# EAGLE design elevator-motherboard-revA (EAGLE 9.4.0)
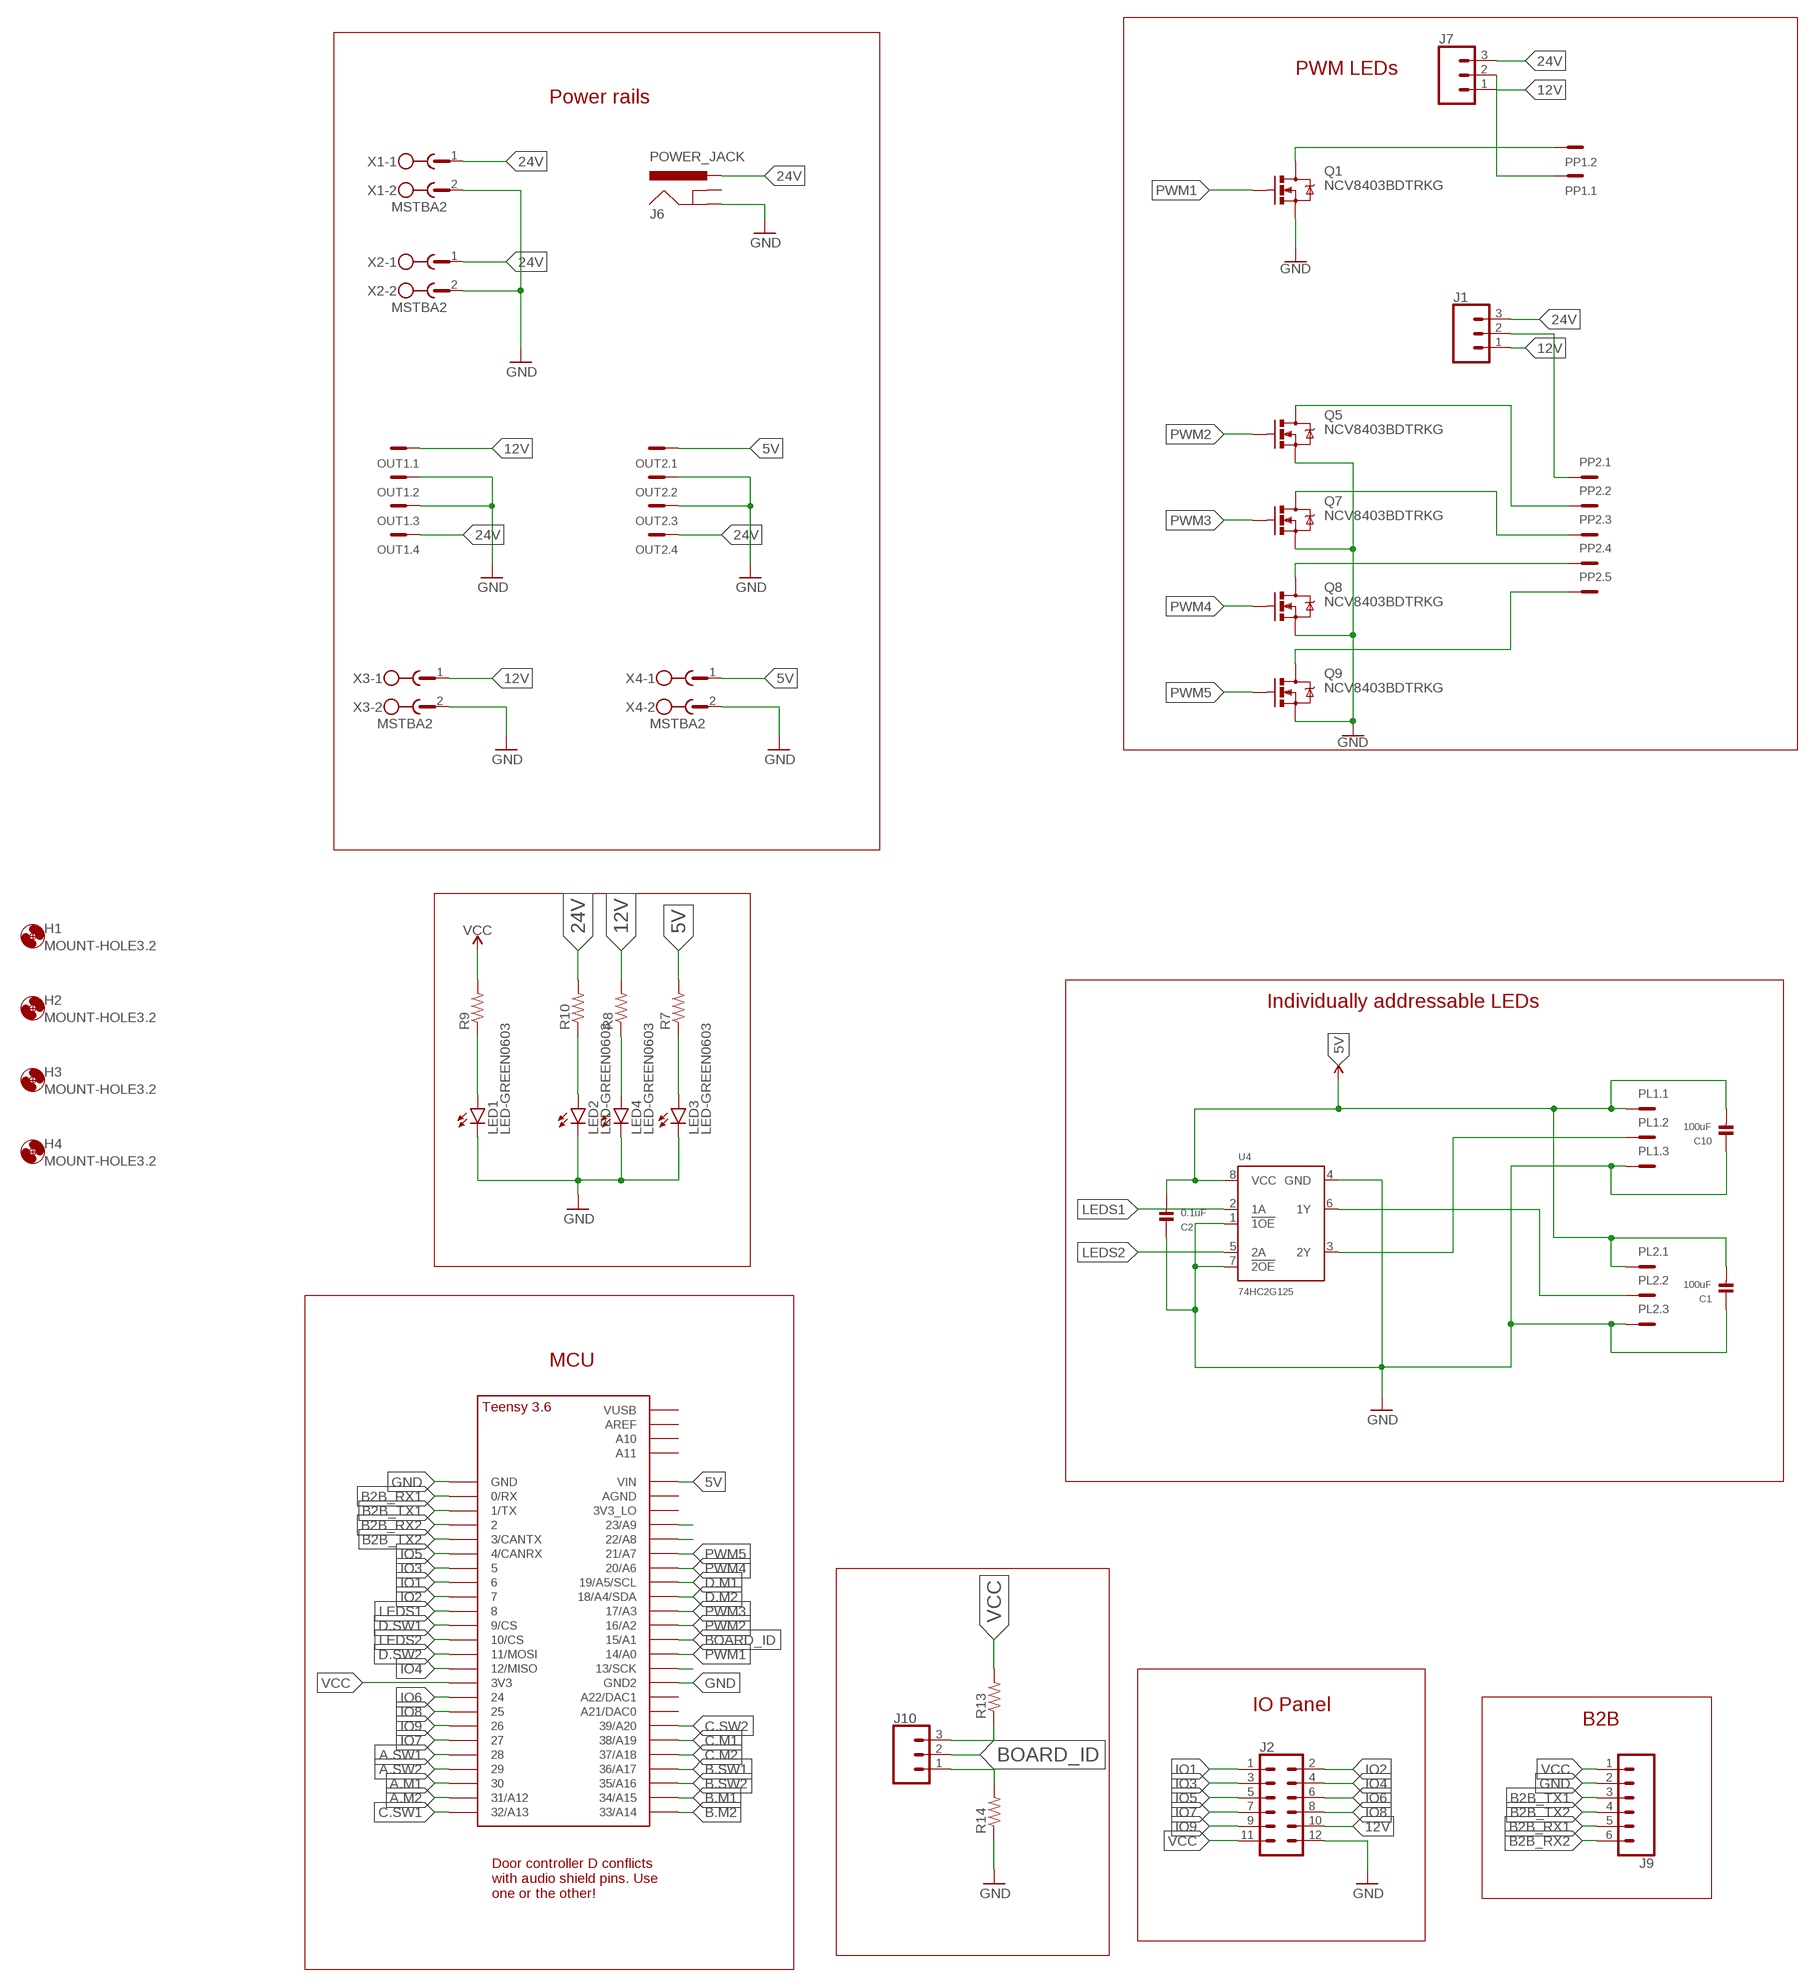
[diagram p0: schematic, sheet 1, part 1 of 2]
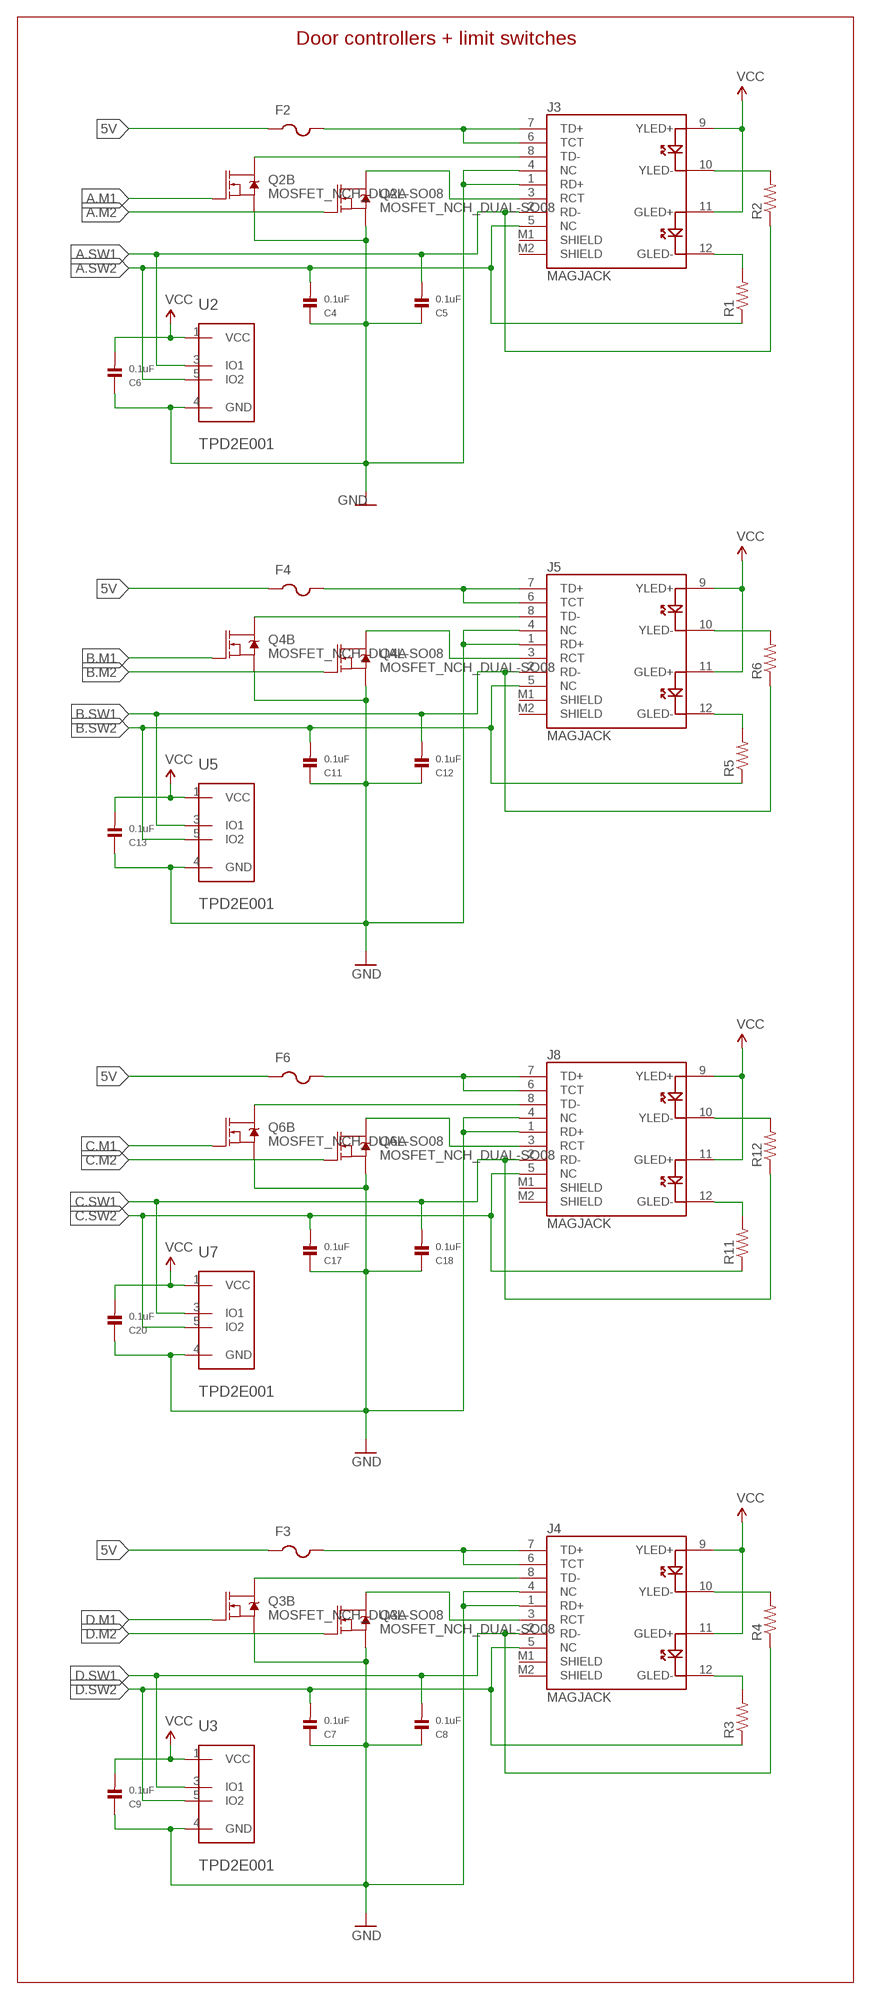
[diagram p1: schematic, sheet 1, part 2 of 2]

## Parts
C1  100uF  CAP_CERAMIC1206  [1206]
C2  0.1uF  CAP_CERAMIC0603  [0603]
C4  0.1uF  CAP_CERAMIC0603  [0603]
C5  0.1uF  CAP_CERAMIC0603  [0603]
C6  0.1uF  CAP_CERAMIC0603  [0603]
C7  0.1uF  CAP_CERAMIC0603  [0603]
C8  0.1uF  CAP_CERAMIC0603  [0603]
C9  0.1uF  CAP_CERAMIC0603  [0603]
C10  100uF  CAP_CERAMIC1206  [1206]
C11  0.1uF  CAP_CERAMIC0603  [0603]
C12  0.1uF  CAP_CERAMIC0603  [0603]
C13  0.1uF  CAP_CERAMIC0603  [0603]
C17  0.1uF  CAP_CERAMIC0603  [0603]
C18  0.1uF  CAP_CERAMIC0603  [0603]
C20  0.1uF  CAP_CERAMIC0603  [0603]
F2  PTCFUSE-1206  [R1206]
F3  PTCFUSE-1206  [R1206]
F4  PTCFUSE-1206  [R1206]
F6  PTCFUSE-1206  [R1206]
H1  MOUNT-HOLE3.2  [3,2]
H2  MOUNT-HOLE3.2  [3,2]
H3  MOUNT-HOLE3.2  [3,2]
H4  MOUNT-HOLE3.2  [3,2]
J1  CONN_03  [1X03]
J2  CONN_06X22X6SHR  [2X6-SHROUDED]
J3  MAGJACK  [MAGJACK]
J4  MAGJACK  [MAGJACK]
J5  MAGJACK  [MAGJACK]
J6  POWER_JACK  [POWER_JACK_PTH]
J7  CONN_03  [1X03]
J8  MAGJACK  [MAGJACK]
J9  CONN_06NO_SILK_FEMALE_PTH  [1X06_NO_SILK]
J10  CONN_03  [1X03]
LED1  LED-GREEN0603  [0603-GREEN]
LED2  LED-GREEN0603  [0603-GREEN]
LED3  LED-GREEN0603  [0603-GREEN]
LED4  LED-GREEN0603  [0603-GREEN]
OUT1  MC4  [MC4]
OUT2  MC4  [MC4]
PL1  MC3  [MC3]
PL2  MC3  [MC3]
PP1  MC2  [MC2]
PP2  MC5  [MC5]
Q1  NCV8403BDTRKG  MOSFET-NCHANNELFDD8780  [DPAK]
Q2  MOSFET_NCH_DUAL-SO08  [SO08]
Q3  MOSFET_NCH_DUAL-SO08  [SO08]
Q4  MOSFET_NCH_DUAL-SO08  [SO08]
Q5  NCV8403BDTRKG  MOSFET-NCHANNELFDD8780  [DPAK]
Q6  MOSFET_NCH_DUAL-SO08  [SO08]
Q7  NCV8403BDTRKG  MOSFET-NCHANNELFDD8780  [DPAK]
Q8  NCV8403BDTRKG  MOSFET-NCHANNELFDD8780  [DPAK]
Q9  NCV8403BDTRKG  MOSFET-NCHANNELFDD8780  [DPAK]
R1  R-US_R0603  [R0603]
R2  R-US_R0603  [R0603]
R3  R-US_R0603  [R0603]
R4  R-US_R0603  [R0603]
R5  R-US_R0603  [R0603]
R6  R-US_R0603  [R0603]
R7  R-US_R0603  [R0603]
R8  R-US_R0603  [R0603]
R9  R-US_R0603  [R0603]
R10  R-US_R0603  [R0603]
R11  R-US_R0603  [R0603]
R12  R-US_R0603  [R0603]
R13  R-US_R0603  [R0603]
R14  R-US_R0603  [R0603]
U2  TPD2E001  [SOT23-5L]
U3  TPD2E001  [SOT23-5L]
U4  74HC2G125  [TSSOP8]
U5  TPD2E001  [SOT23-5L]
U7  TPD2E001  [SOT23-5L]
U$1  TEENSY_3.5/3.6_BASIC  [TEENSY_3.5/3.6_BASIC]
X1  MSTBA2  [MSTBA2]
X2  MSTBA2  [MSTBA2]
X3  MSTBA2  [MSTBA2]
X4  MSTBA2  [MSTBA2]

## Nets
5V: C1.2 C2.2 C10.2 F2.1 F3.1 F4.1 F6.1 OUT2.1 PL1.1 PL2.1 R7.2 U4.8(VCC) U$1.VIN X4.1 ; supply symbol labelled 12V
12V: J1.1 J2.10 J7.1 OUT1.1 R8.2 X3.1
24V: J1.3 J6.PWR J7.3 OUT1.4 OUT2.4 R10.2 X1.1 X2.1
A.M1: Q2.4(B:G) U$1.30
A.M2: Q2.2(A:G) U$1.31/A12
A.SW1: C5.2 J3.2(RD-) R2.1 U2.3(IO1) U$1.28
A.SW2: C4.2 J3.5(NC) R1.1 U2.5(IO2) U$1.29
B2B_RX1: J9.5 U$1.0/RX
B2B_RX2: J9.6 U$1.2
B2B_TX1: J9.3 U$1.1/TX
B2B_TX2: J9.4 U$1.3/CANTX
B.M1: Q4.4(B:G) U$1.34/A15
B.M2: Q4.2(A:G) U$1.33/A14
B.SW1: C12.2 J5.2(RD-) R6.1 U5.3(IO1) U$1.36/A17
B.SW2: C11.2 J5.5(NC) R5.1 U5.5(IO2) U$1.35/A16
BOARD_ID: J10.2 U$1.15/A1
C.M1: Q6.4(B:G) U$1.38/A19
C.M2: Q6.2(A:G) U$1.37/A18
C.SW1: C18.2 J8.2(RD-) R12.1 U7.3(IO1) U$1.32/A13
C.SW2: C17.2 J8.5(NC) R11.1 U7.5(IO2) U$1.39/A20
D.M1: Q3.4(B:G) U$1.19/A5/SCL
D.M2: Q3.2(A:G) U$1.18/A4/SDA
D.SW1: C8.2 J4.2(RD-) R4.1 U3.3(IO1) U$1.9/CS
D.SW2: C7.2 J4.5(NC) R3.1 U3.5(IO2) U$1.11/MOSI
GND: C1.1 C2.1 C4.1 C5.1 C6.1 C7.1 C8.1 C9.1 C10.1 C11.1 C12.1 C13.1 C17.1 C18.1 C20.1 J2.12 J3.1(RD+) J3.4(NC) J4.1(RD+) J4.4(NC) J5.1(RD+) J5.4(NC) J6.GND J8.1(RD+) J8.4(NC) J9.2 LED1.C LED2.C LED3.C LED4.C OUT1.2 OUT1.3 OUT2.2 OUT2.3 PL1.3 PL2.3 Q1.3(S) Q2.1(A:S) Q2.3(B:S) Q3.1(A:S) Q3.3(B:S) Q4.1(A:S) Q4.3(B:S) Q5.3(S) Q6.1(A:S) Q6.3(B:S) Q7.3(S) Q8.3(S) Q9.3(S) R14.1 U2.4(GND) U3.4(GND) U4.1(!1OE) U4.4(GND) U4.7(!2OE) U5.4(GND) U7.4(GND) U$1.GND U$1.GND2 X1.2 X2.2 X3.2 X4.2
IO1: J2.1 U$1.6
IO2: J2.2 U$1.7
IO3: J2.3 U$1.5
IO4: J2.4 U$1.12/MISO
IO5: J2.5 U$1.4/CANRX
IO6: J2.6 U$1.24
IO7: J2.7 U$1.27
IO8: J2.8 U$1.25
IO9: J2.9 U$1.26
LEDS1: U4.2(1A) U$1.8
LEDS2: U4.5(2A) U$1.10/CS
N$1: F2.2 J3.6(TCT) J3.7(TD+)
N$2: J3.8(TD-) Q2.5(B:D) Q2.6(B:D)
N$3: J3.3(RCT) Q2.7(A:D) Q2.8(A:D)
N$4: PP1.2 Q1.4(D)
N$5: PL2.2 U4.6(1Y)
N$6: PL1.2 U4.3(2Y)
N$7: J3.10(YLED-) R2.2
N$8: J3.12(GLED-) R1.2
N$9: F3.2 J4.6(TCT) J4.7(TD+)
N$10: J4.8(TD-) Q3.5(B:D) Q3.6(B:D)
N$11: J4.3(RCT) Q3.7(A:D) Q3.8(A:D)
N$12: J4.10(YLED-) R4.2
N$13: PP2.2 Q5.4(D)
N$14: PP2.3 Q7.4(D)
N$15: PP2.4 Q8.4(D)
N$16: PP2.5 Q9.4(D)
N$17: J4.12(GLED-) R3.2
N$18: F4.2 J5.6(TCT) J5.7(TD+)
N$19: J5.8(TD-) Q4.5(B:D) Q4.6(B:D)
N$20: J5.3(RCT) Q4.7(A:D) Q4.8(A:D)
N$21: J5.10(YLED-) R6.2
N$22: J5.12(GLED-) R5.2
N$23: LED1.A R9.1
N$24: LED2.A R10.1
N$25: LED3.A R7.1
N$26: LED4.A R8.1
N$27: J10.3 R13.1
N$28: F6.2 J8.6(TCT) J8.7(TD+)
N$29: J8.8(TD-) Q6.5(B:D) Q6.6(B:D)
N$30: J8.3(RCT) Q6.7(A:D) Q6.8(A:D)
N$31: J8.10(YLED-) R12.2
N$32: J8.12(GLED-) R11.2
N$33: J10.1 R14.2
N$34: J7.2 PP1.1
N$35: J1.2 PP2.1
N$50: U$1.23/A9
N$51: U$1.22/A8
N$60: U$1.13/SCK
PWM1: Q1.1(G) U$1.14/A0
PWM2: Q5.1(G) U$1.16/A2
PWM3: Q7.1(G) U$1.17/A3
PWM4: Q8.1(G) U$1.20/A6
PWM5: Q9.1(G) U$1.21/A7
VCC: C6.2 C9.2 C13.2 C20.2 J2.11 J3.9(YLED+) J3.11(GLED+) J4.9(YLED+) J4.11(GLED+) J5.9(YLED+) J5.11(GLED+) J8.9(YLED+) J8.11(GLED+) J9.1 R9.2 R13.2 U2.1(VCC) U3.1(VCC) U5.1(VCC) U7.1(VCC) U$1.3V3
Unconnected: J3.M1(SHIELD) J3.M2(SHIELD) J4.M1(SHIELD) J4.M2(SHIELD) J5.M1(SHIELD) J5.M2(SHIELD) J6.GNDBREAK J8.M1(SHIELD) J8.M2(SHIELD) U$1.3V3_LO U$1.21/DAC0(A21/DAC0) U$1.A10 U$1.A11 U$1.A22/DAC1 U$1.AGND U$1.AREF U$1.VUSB

## Notes on the sheet
- Door controllers + limit switches
- PWM LEDs
- Power rails
- Individually addressable LEDs
- MCU
- IO Panel
- B2B
- Door controller D conflicts
  with audio shield pins. Use
  one or the other!

## Library data of the parts
C1 C2 C4-C13 C17 C18 C20 = microbuilder:CAP_CERAMIC: Ceramic Capacitors 0402 - 0402 Surface Mount Capacitors 16pF 50V 5% [Digikey: 445-4899-2-ND] 18pF 50V 5% [Digikey: 490-1281-2-ND] 22pF 50V 5% [Digikey: 490-1283-2-ND] 68pF 50V 5% [Digikey: 490-1289-2-ND] 0.1uF 10V 10% [Digikey: 490-1318-2-ND] 1.0uF 6.3V 10% [Digikey: 490-1320-2-ND] 0603 - 0603 Surface Mount Capacitors 16 pF 50V 5% [Digikey: 445-5051-2-ND] 22 pF 50V [Digikey: PCC220ACVTR-ND] 33 pF 50V 5% [Digikey: 490-1415-1-ND] 56pF 50V 5% [Digikey: 490-1421-1-ND] 220pF 50V 5% [Digikey: 445-1285-1-ND] 680 pF 50V 2200 pF 50V 5% C0G [Digikey: 445-1297-1-ND] 5600 pF 100V 5% X7R [Digikey: 478-3711-1-ND] 0.1 µF 25V 10% [Digikey: PCC2277TR-ND] 0.22 µF 16V 10% X7R [Digikey: 445-1318-1-ND] 1.0 µF 25V 10% [Digikey: 445-5146-2-ND] 0603 - RF Specific 3pF 250V +/-0.1pF RF [Digikey: 712-1347-1-ND] 18 pF 250V 5% [Digikey: 478-3505-1-ND or 712-1322-1-ND] 56 pF 250V 5% C0G RF [Digikey: 490-4867-1-ND] 68 pF 250V RF [Digikey: 490-4868-1-ND] 0805 - 0805 Surface Mount Capacitors 220 pF 250V 2% RF Ceramic Capacitor [Digikey: 712-1398-1-ND] 1000 pF 50V 2% NP0 Ceramic Capacitor [Digikey: 478-3760-1-ND] 0.1 µF 25V 10% Ceramic Capacitor [Digikey: PCC1828TR-ND] 1.0 µF 16V 10% Ceramic Capacitor[Digikey: 490-1691-2-ND] 10.0 µF 10V 10% Ceramic Capacitor[Digikey: 709-1228-1-ND] 10.0 uF 16V 10% Ceramic Capacitor [Digikey: 478-5165-2-ND] 47 uF 6.3V 20% Ceramic Capacitor [Digikey: 587-1779-1-ND or 399-5506-1-ND] 1206 - 1206 Surface Mount Capacitors 47uF 10V 20% Ceramic Capacitor [Digikey: 490-5528-1-ND or 399-5508-1-ND or 445-6010-1-ND] 100uF 6.3V -20%, +80% Y5V Ceramic Capacitor (Digikey: 490-4512-1-ND, Mouser: 81-GRM31CF50J107ZE1L)
F2-F4 F6 = adafruit:PTCFUSE: PTC fuses, resettable thermistors
H1-H4 = holes:MOUNT-HOLE: MOUNTING HOLE with drill center marker
J1 J7 J10 = SparkFun-Connectors:CONN_03: Multi connection point. Often used as Generic Header-pin footprint for 0.1 inch spaced/style header connections On any of the 0.1 inch spaced packages, you can populate with these: Break Away Headers - Straight <https://www.sparkfun.com/products/116> (PRT-00116) Break Away Male Headers - Right Angle <https://www.sparkfun.com/products/553> (PRT-00553) Female Headers <https://www.sparkfun.com/products/115> (PRT-00115) Break Away Headers - Machine Pin <https://www.sparkfun.com/products/117> (PRT-00117) Break Away Female Headers - Swiss Machine Pin <https://www.sparkfun.com/products/743> (PRT-00743) Stackable Header - 3 Pin (Female, 0.1") <https://www.sparkfun.com/products/13875> (PRT-13875) For SCREWTERMINALS and SPRING TERMINALS visit here: Screw Terimnals on SparkFun.com <https://www.sparkfun.com/search/results?term=Screw+Terminals> (5mm/3.5mm/2.54mm spacing) This device is also useful as a general connection point to wire up your design to another part of your project. Our various solder wires solder well into these plated through hole pads. Hook-Up Wire - Assortment (Stranded, 22 AWG) <https://www.sparkfun.com/products/11375> (PRT-11375) Hook-Up Wire - Assortment (Solid Core, 22 AWG) <https://www.sparkfun.com/products/11367> (PRT-11367) View the entire wire category on our website here <https://www.sparkfun.com/categories/141> Special notes: Molex polarized connector foot print use with SKU : PRT-08232 with associated crimp pins and housings.
J2 = SparkFun-Connectors:CONN_06X2: Multi connection point. Often used as Generic Header-pin footprint for 0.1 inch spaced/style header connections On any of the 0.1 inch spaced packages, you can populate with these: Break Away Headers - Straight <https://www.sparkfun.com/products/116> (PRT-00116) Break Away Male Headers - Right Angle <https://www.sparkfun.com/products/553> (PRT-00553) Female Headers <https://www.sparkfun.com/products/115> (PRT-00115) Break Away Headers - Machine Pin <https://www.sparkfun.com/products/117> (PRT-00117) Break Away Female Headers - Swiss Machine Pin <https://www.sparkfun.com/products/743> (PRT-00743)
J3-J5 J8 = SparkFun-Connectors:MAGJACK: MAGJACK: RJ-45 with LEDs This is a single port, RJ45 ethernet jacks with built in transformer (magnetics), status LEDs, and shielding. Here is the connector we sell at SparkFun: RJ45 Ethernet MagJack-Compatible <https://www.sparkfun.com/products/8534> (PRT-08534) Datasheet <http://www.sparkfun.com/datasheets/Prototyping/MagJack.pdf> It is used on this SparkFun product: SparkFun RJ45 MagJack Breakout <https://www.sparkfun.com/products/13021> (BOB-13021); PROD_ID: CONN-09556; SF_ID: PRT-08534
J6 = SparkFun-Connectors:POWER_JACK: Power Jack Connector This is the standard 5.5mm barrel jack for power. The PTH is the most common, proven, reliable, footprint. The Slot footprint only works if the mill layer is transmitted to the PCB fab house so be warned. Here are the connectors we sell at SparkFun: DC Barrel Power Jack/Connector <https://www.sparkfun.com/products/119> (PRT-00119) DC Barrel Power Jack/Connector (SMD) <https://www.sparkfun.com/products/12748> (PRT-12748) DC Barrel Jack Adapter - Breadboard Compatible <https://www.sparkfun.com/products/10811> (PRT-10811) It is used on this SparkFun product (and many, many others): SparkFun RedBoard - Programmed with Arduino <https://www.sparkfun.com/products/12757> (DEV-12757) Also, if you need a mating power supply or connector, please check these out: Wall Adapter Power Supply - 9VDC 650mA <https://www.sparkfun.com/products/298> (TOL-00298) DC Barrel Jack Adapter - Male <https://www.sparkfun.com/products/10287> (PRT-10287); PROD_ID: CONN-08197
J9 = SparkFun-Connectors:CONN_06: Multi connection point. Often used as Generic Header-pin footprint for 0.1 inch spaced/style header connections On any of the 0.1 inch spaced packages, you can populate with these: Break Away Headers - Straight <https://www.sparkfun.com/products/116> (PRT-00116) Break Away Male Headers - Right Angle <https://www.sparkfun.com/products/553> (PRT-00553) Female Headers <https://www.sparkfun.com/products/115> (PRT-00115) Break Away Headers - Machine Pin <https://www.sparkfun.com/products/117> (PRT-00117) Break Away Female Headers - Swiss Machine Pin <https://www.sparkfun.com/products/743> (PRT-00743) Arduino Stackable Header - 6 Pin <https://www.sparkfun.com/products/9280> (PRT-09280) For SCREWTERMINALS and SPRING TERMINALS visit here: Screw Terimnals on SparkFun.com <https://www.sparkfun.com/search/results?term=Screw+Terminals> (5mm/3.5mm/2.54mm spacing) This device is also useful as a general connection point to wire up your design to another part of your project. Our various solder wires solder well into these plated through hole pads. Hook-Up Wire - Assortment (Stranded, 22 AWG) <https://www.sparkfun.com/products/11375> (PRT-11375) Hook-Up Wire - Assortment (Solid Core, 22 AWG) <https://www.sparkfun.com/products/11367> (PRT-11367) View the entire wire category on our website here <https://www.sparkfun.com/categories/141>; PROD_ID: CONN-08437
LED1-LED4 = BeagleBone_Blue_R3:LED-GREEN
OUT1 OUT2 = con-phoenix-381_l:MC4: Mini-Combicon 3.81mm horizontal 4-polig (ohne Gegenstecker)
PL1 PL2 = con-phoenix-381_l:MC3: Mini-Combicon 3.81mm horizontal 3-polig (ohne Gegenstecker)
PP1 = con-phoenix-381_l:MC2: Mini-Combicon 3.81mm horizontal 2-polig (ohne Gegenstecker)
PP2 = DS91M040TSQ:MC5
Q1 Q5 Q7-Q9 = BeagleBone_Blue_R3:MOSFET-NCHANNEL: Common NMOSFET Parts MFG P/N Store ID Prod ID FDD8780 TRANS-09984 SI7820DN TRANS-11055 FDS6630A IC-08089 2N7002PW TRANS-11151 FQP30N06L COM-10213 TRANS-10060 BSS123LT1G TRANS-08345 BSS138 TRANS-00830 BS170 2N7000; PROD_ID: TRANS-09984
Q2-Q4 Q6 = SparkFun-DiscreteSemi:MOSFET_NCH_DUAL: Dual N-Channel 30-VDS MOSFET Link to datasheet <https://www.fairchildsemi.com/datasheets/FD/FDMA1024NZ.pdf> SparkFun Products: SparkFun Mini FET Shield <https://www.sparkfun.com/products/9627>
R1-R14 = adafruit:R-US_: RESISTOR, American symbol
U2 U3 U5 U7 = shlomo:TPD2E001
U4 = Custom:74HC2G125
U$1 = Teensy356:TEENSY_3.5/3.6_BASIC
X1-X4 = con-phoenix-508:MSTBA2: PHOENIX; MF: FARNELL; MPN: 1757242; OC_FARNELL: 3705171; OC_NEWARK: 71C4161

## Board
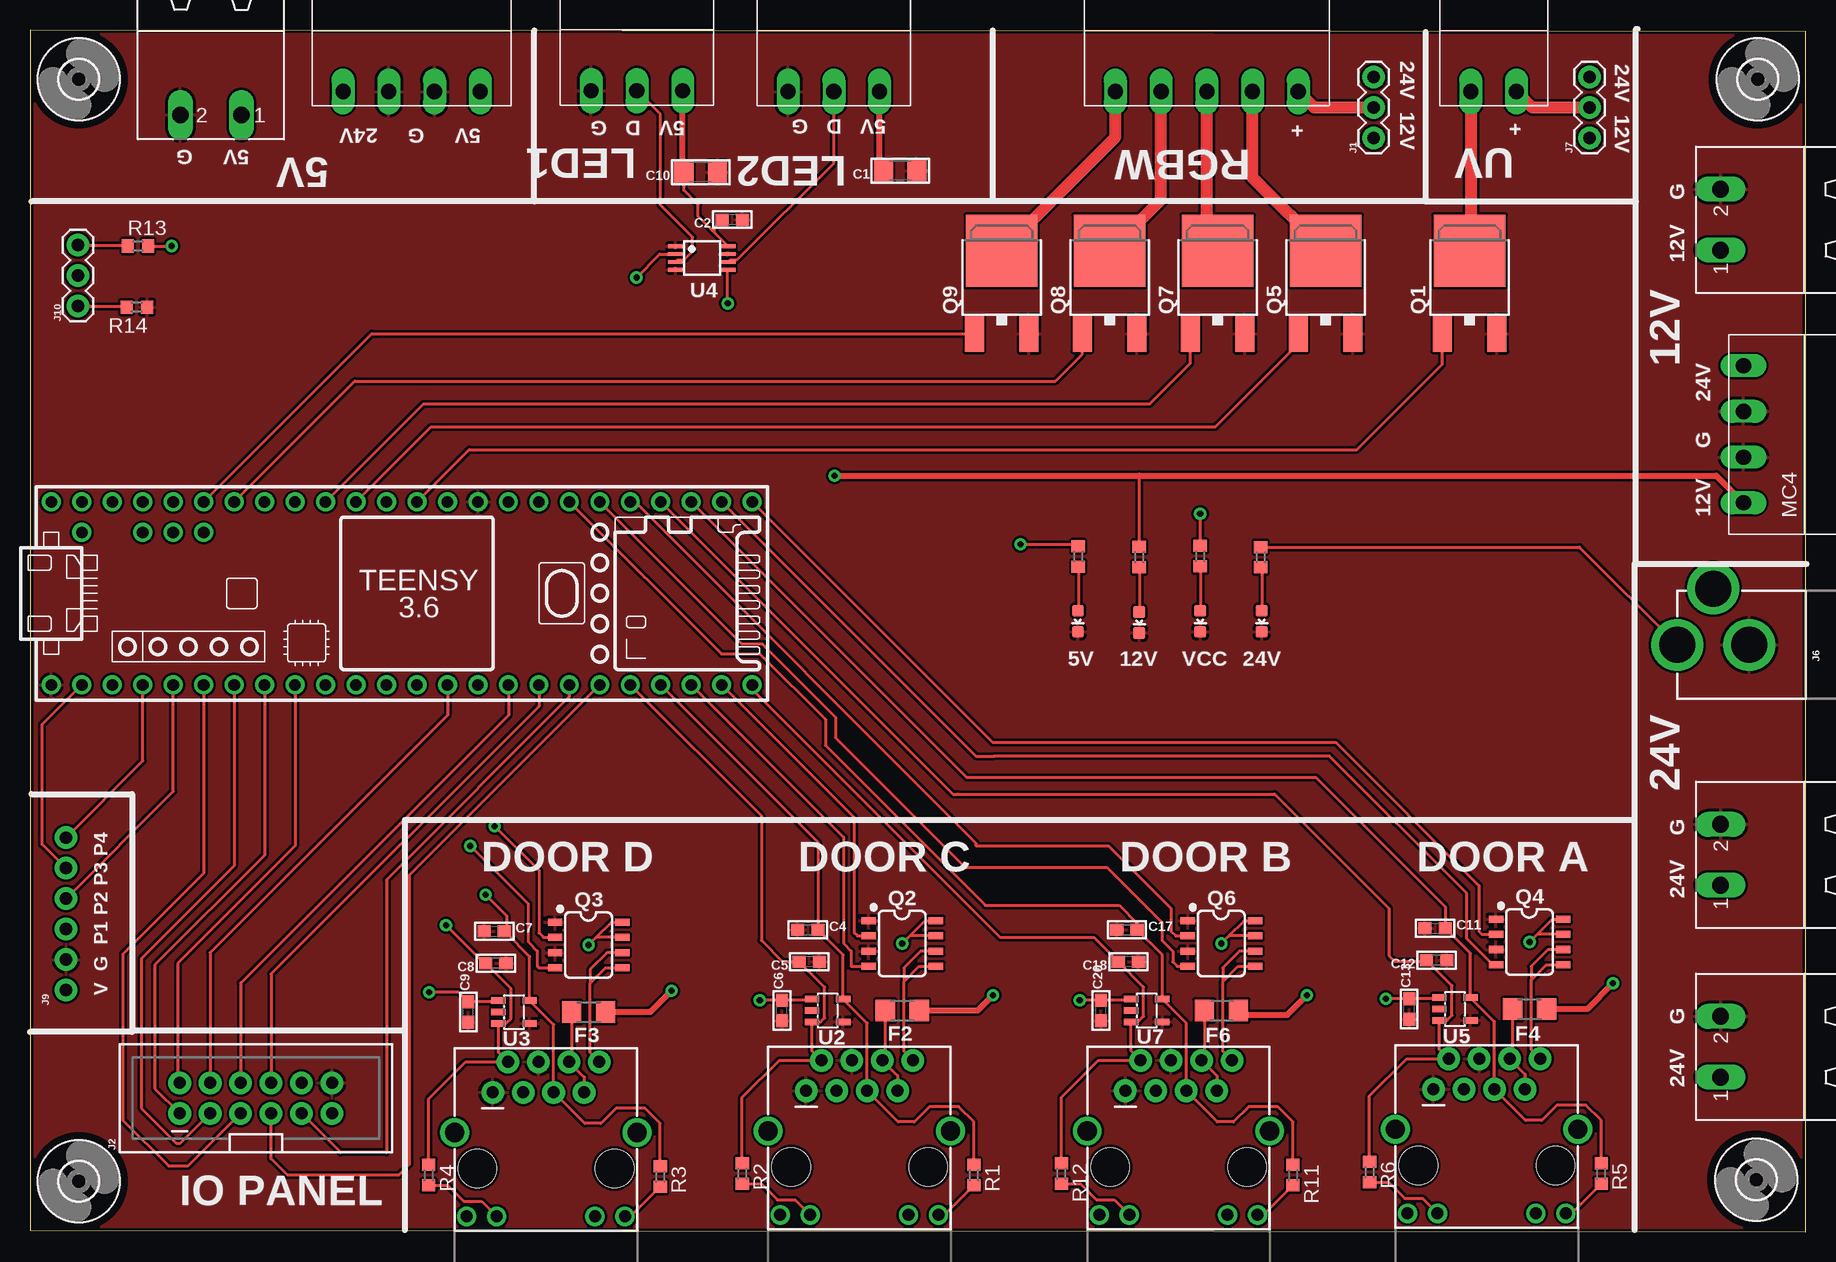
[diagram p2: board, top side]
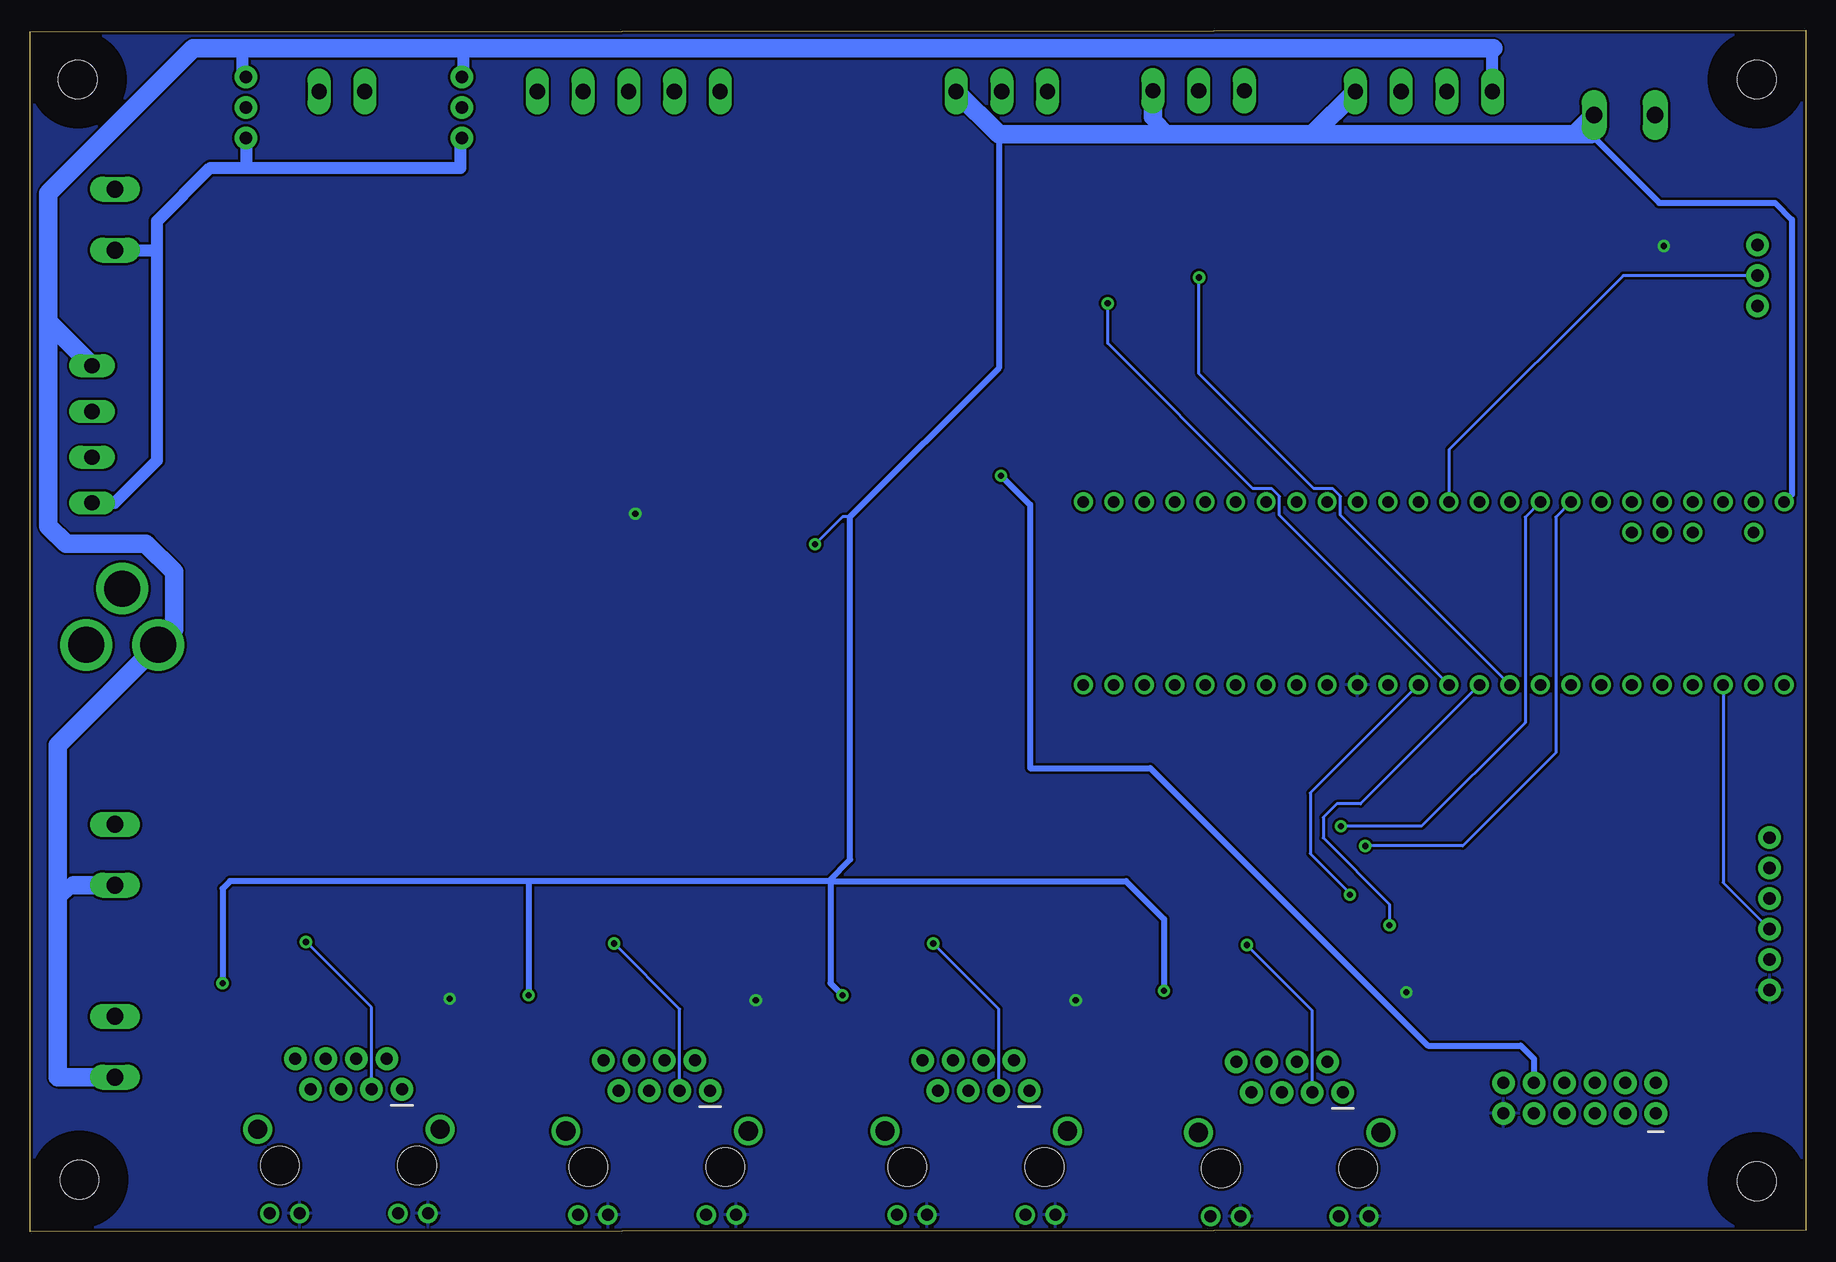
[diagram p3: board, bottom side, seen from below]

Size 148 x 100.13 mm. Coordinates in mm from the lower left corner, seen from the top.
Outline: 0,0.13 148,0 148,100 0,100.13 0,0.13
Copper layers (1*16): Top 0.035mm / dielectric 1.5mm / Bottom 0.035mm
Design rules "SparkFun": minimum track width 8mil, minimum drill 20mil, track to track 8mil, track to pad 8mil, pad to pad 8mil, via to via 8mil, smd to smd 8mil, copper to edge 10mil, drill to drill 8mil, minimum pad ring 12mil, minimum via ring 10mil, stop-mask expansion 4mil, vias tented up to drill 25mil, thermal gap 10mil

### Footprints (pad centres in the part's own frame; a part is rotated, then mirrored left to right if it is on the bottom)
1206 = smd 1.6 x 1.8: 1 -1.4,0; 2 1.4,0
0603 = smd 1.1 x 1: 1 -0.85,0; 2 0.85,0
R1206 = smd 1.6 x 1.803: 1 -1.422,0; 2 1.422,0
3,2 = hole 3.2: 0,0
1X03 = drill 1.016 pad 1.88: 1 0,0; 2 2.54,0; 3 5.08,0
2X6-SHROUDED = drill 1.016 pad 1.88: 1 -1.27,6.35; 2 1.27,6.35; 3 -1.27,3.81; 4 1.27,3.81; 5 -1.27,1.27; 6 1.27,1.27; 7 -1.27,-1.27; 8 1.27,-1.27; 9 -1.27,-3.81; 10 1.27,-3.81; 11 -1.27,-6.35; 12 1.27,-6.35
MAGJACK = drill 1 pad 1.88: 1 3.175,17.445; 2 4.445,19.985; 3 5.715,17.445; 4 6.985,19.985; 5 8.255,17.445; 6 9.525,19.985; 7 10.795,17.445; 8 12.065,19.985 | drill 1 pad 1.27: 9 1,7.1; 10 3.5,7.1; 11 11.7,7.1; 12 14.2,7.1 | drill 1.6 pad 2.184: M1 0,14.1; M2 15.2,14.1 | hole 3.2: 1.905,11.095; 13.335,11.095
POWER_JACK_PTH = drill 2.997 pad 4.318: GND 0,7.7; GNDBREAK 4.7,10.7; PWR 0,13.7
1X06_NO_SILK = drill 1.016 pad 1.88: 1 0,0; 2 2.54,0; 3 5.08,0; 4 7.62,0; 5 10.16,0; 6 12.7,0
0603-GREEN = smd 1 x 1: A 0,-0.877; C 0,0.877
MC4 = drill 1.27 long: 1 -5.715,0; 2 -1.905,0; 3 1.905,0; 4 5.715,0
MC3 = drill 1.27 long: 1 -3.81,0; 2 0,0; 3 3.81,0
MC2 = drill 1.27 long: 1 -1.905,0; 2 1.905,0
MC5 = drill 1.27 long: 1 -5.715,0; 2 -1.905,0; 3 1.905,0; 4 5.715,0; 5 9.525,0
DPAK = smd 1.6 x 2.997: 1 -2.28,-5.31; 3 2.28,-5.31 | smd 5.994 x 5.994: 4 0,1.588
SO08 = smd 0.6 x 1.2: 1 -1.905,-2.8; 2 -0.635,-2.8; 3 0.635,-2.8; 4 1.905,-2.8; 5 1.905,2.8; 6 0.635,2.8; 7 -0.635,2.8; 8 -1.905,2.8
R0603 = smd 1 x 1.1: 1 -0.85,0; 2 0.85,0
SOT23-5L = smd 0.55 x 1.2: 1 -0.95,-1.3; 2 0,-1.3; 3 0.95,-1.3; 4 0.95,1.3; 5 -0.95,1.3
TSSOP8 = smd 1.2 x 0.305: 1 -2.2,0.975; 2 -2.2,0.325; 3 -2.2,-0.325; 4 -2.2,-0.975; 5 2.2,-0.975; 6 2.2,-0.325; 7 2.2,0.325; 8 2.2,0.975
TEENSY_3.5/3.6_BASIC = drill 0.965: 0/RX -25.4,-7.62; 1/TX -22.86,-7.62; 2 -20.32,-7.62; 3/CANTX -17.78,-7.62; 3V3 7.62,-7.62; 3V3_LO -22.86,7.62; 4/CANRX -15.24,-7.62; 5 -12.7,-7.62; 6 -10.16,-7.62; 7 -7.62,-7.62; 8 -5.08,-7.62; 9/CS -2.54,-7.62; 10/CS 0,-7.62; 11/MOSI 2.54,-7.62; 12/MISO 5.08,-7.62; 13/SCK 5.08,7.62; 14/A0 2.54,7.62; 15/A1 0,7.62; 16/A2 -2.54,7.62; 17/A3 -5.08,7.62; 18/A4/SDA -7.62,7.62; 19/A5/SCL -10.16,7.62; 20/A6 -12.7,7.62; 21/A7 -15.24,7.62; 21/DAC0 12.7,7.62; 22/A8 -17.78,7.62; 23/A9 -20.32,7.62; 24 10.16,-7.62; 25 12.7,-7.62; 26 15.24,-7.62; 27 17.78,-7.62; 28 20.32,-7.62; 29 22.86,-7.62; 30 25.4,-7.62; 31/A12 27.94,-7.62; 32/A13 30.48,-7.62; 33/A14 30.48,7.62; 34/A15 27.94,7.62; 35/A16 25.4,7.62; 36/A17 22.86,7.62; 37/A18 20.32,7.62; 38/A19 17.78,7.62; 39/A20 15.24,7.62; A10 -17.78,5.08; A11 -15.24,5.08; A22/DAC1 10.16,7.62; AGND -25.4,7.62; AREF -20.32,5.08; GND -27.94,-7.62; GND2 7.62,7.62; VIN -27.94,7.62; VUSB -25.4,5.08
MSTBA2 = drill 1.397 long: 1 -2.54,5.08; 2 2.54,5.08

### Placement (x,y rotation side)
C1  72.54,88.4 180 top
C2  58.55,84.33 180 top
C4  64.83,25.15 0 top
C5  64.96,22.48 180 top
C6  62.68,18.41 90 top
C7  38.7,25.02 0 top
C8  38.82,22.35 180 top
C9  36.54,18.29 90 top
C10  55.9,88.29 180 top
C11  117.12,25.27 0 top
C12  117.25,22.61 180 top
C13  114.97,18.54 90 top
C17  91.44,25.15 0 top
C18  91.56,22.48 180 top
C20  89.28,18.41 90 top
F2  72.71,18.41 180 top
F3  46.57,18.29 180 top
F4  125,18.54 180 top
F6  99.31,18.41 180 top
H1  4.06,4.19 0 top
H2  143.89,4.32 0 top
H3  144.02,96.01 0 top
H4  4.06,96.01 0 top
J1  112,91.13 90 top
J2  18.83,11.12 90 top
J3  61.53,-5.71 0 top
J4  35.39,-5.84 0 top
J5  113.82,-5.59 0 top
J6  151.02,48.88 90 top
J7  130,91.13 90 top
J8  88.13,-5.71 0 top
J9  3,20.13 90 top
J10  4,77.13 90 top
LED1  97.55,50.86 180 top
LED2  102.67,50.86 180 top
LED3  87.36,50.86 180 top
LED4  92.47,50.76 180 top
OUT1  142.82,66.44 90 top
OUT2  31.81,95 180 top
PL1  50.59,95.06 180 top
PL2  67,95 180 top
PP1  122,95 180 top
PP2  100,95 180 top
Q1  120,80.13 0 top
Q2  72.71,24 270 top
Q3  46.57,23.88 270 top
Q4  125,24.13 270 top
Q5  108,80.13 0 top
Q6  99.31,24 270 top
Q7  99,80.13 0 top
Q8  90,80.13 0 top
Q9  81,80.13 0 top
R1  78.68,4.7 270 top
R2  59.37,4.83 270 top
R3  52.54,4.57 270 top
R4  33.23,4.7 270 top
R5  130.97,4.83 270 top
R6  111.66,4.95 270 top
R7  87.38,56.25 90 top
R8  92.46,56.2 90 top
R9  97.54,56.28 90 top
R10  102.59,56.19 90 top
R11  105.28,4.7 270 top
R12  85.97,4.83 270 top
R13  9,82.13 0 top
R14  8.91,77.03 180 top
U2  66.49,18.41 270 top
U3  40.35,18.29 270 top
U4  56,81.13 0 top
U5  118.78,18.54 270 top
U7  93.09,18.41 270 top
U$1  29.72,53.18 0 top
X1  146,31.4 90 top
X2  146,15.4 90 top
X3  146,84.32 90 top
X4  15.08,98.13 180 top

### Tracks (layer width: path | path; a pad name or v marks a point on that pad's centre or on a via)
5V  (via drill 0.51)
  Top 0.254: U4.8 57.07,83.23 | 57.07,83.23 55.7,84.6 55.7,85.57 54.5,86.77 C10.2 | 57.07,83.23 57.07,83.7 C2.2 | v82.55,57.28 87.2,57.28 R7.2
  Top 0.508: C1.2 70.81,88.73 PL2.1 | C10.2 54.4,88.39 PL1.1 | v131.95,20.7 129.79,18.54 F4.1 | v106.43,19.68 104.78,18.03 101.09,18.03 100.73,18.39 F6.1 | v80.26,19.68 78.99,18.41 F2.1 | v53.47,20.07 51.69,18.29 F3.1
  Bottom 0.254: 79.63,59.56 80.26,59.56 v82.55,57.28
  Bottom 0.508: 17.91,91.44 12.19,85.72 2.54,85.72 1.14,84.33 1.14,61.44 U$1.VIN | 67.25,91.44 67.25,71.94 79.63,59.56 79.63,30.99 81.41,29.21 | 81.41,29.21 106.43,29.21 | 106.43,29.21 131.32,29.21 131.95,28.57 v131.95,20.7 | 106.43,29.21 v106.43,19.68 | 81.28,29.21 81.28,20.7 v80.26,19.68 | 81.41,29.21 81.28,29.21 | 81.28,29.21 56.64,29.21 53.47,26.04 v53.47,20.07
  Bottom 1.016: 54.4,92.88 52.96,91.44
  Bottom 1.524: OUT2.1 41.09,91.44 | PL2.1 67.25,91.44 52.96,91.44 41.09,91.44 | PL1.1 54.4,92.88 | X4.1 19.23,91.44 | 17.91,91.44 19.23,91.44 | 19.23,91.44 41.09,91.44
12V  (via drill 0.51)
  Top 0.254: 92.46,62.99 R8.2
  Top 0.508: v67.06,62.99 92.46,62.99 140.55,62.99 OUT1.1
  Bottom 0.508: v67.06,62.99 64.64,60.58 64.64,38.61 54.61,38.61 31.5,15.49 23.75,15.49 22.64,14.38 J2.10
  Bottom 1.016: OUT1.1 140.95,60.72 137.41,64.26 137.41,82.08 | 137.41,82.08 137.41,84.2 132.97,88.65 129.67,88.65 | 129.67,88.65 112.14,88.65 112.14,90.99 J1.1 | J7.1 130,88.98 129.67,88.65 | X3.1 137.72,81.78 137.41,82.08
24V
  Top 0.254: R10.2 129.16,57.04 J6.PWR
  Bottom 1.016: J6.PWR 136,50.2 | 130.3,98.6 130.3,96.51 J7.3 | 111.89,98.6 111.89,96.32 J1.3 | OUT2.4 26.09,98.54 26.04,98.6 | 144.37,28.86 145.67,27.56
  Bottom 1.524: 136,50.2 136,54.97 138.35,57.32 145,57.32 146.48,58.79 146.48,75.8 | 146.48,75.8 146.48,86.51 134.38,98.6 130.3,98.6 111.89,98.6 26.04,98.6 | OUT1.4 146.48,75.8 | J6.PWR 145.67,40.53 145.67,27.56 145.67,12.86 X2.1 | X1.1 144.37,28.86
A.M1
  Top 0.254: U$1.30 67.82,32.86 67.82,24 68.45,23.37 68.45,22.1 Q2.4
A.M2
  Top 0.254: U$1.31/A12 68.71,34.51 68.71,24.89 68.96,24.64 Q2.2
A.SW1
  Top 0.254: 64.12,22.47 66.23,20.36 66.23,17.81 65.9,17.48 65.2,17.48 U2.3 65.19,15.06 J3.2 62.47,14.27 59.37,11.18 R2.1 | 64.12,22.47 C5.2 | U$1.28 60.96,34.64 60.96,24.26 62.75,22.47 64.12,22.47
A.SW2
  Top 0.254: R1.1 78.68,9.14 77.41,10.41 75,10.41 73.72,9.14 72.37,9.14 J3.5 69.79,17.36 U2.5 67.79,23.04 C4.2 65.69,32.45 U$1.29
B2B_RX1
  Top 0.254: J9.5 1.03,32.26 1.02,32.26 1.02,42.26 U$1.0/RX
B2B_RX2
  Top 0.254: J9.6 9.4,39.23 U$1.2
B2B_TX1
  Bottom 0.254: U$1.1/TX 6.86,29.06 J9.3
B2B_TX2
  Top 0.254: J9.4 11.94,36.69 U$1.3/CANTX
B.M1
  Top 0.254: Q4.4 121.94,22.22 119.76,24.41 119.76,28.19 108.33,39.62 80.39,39.62 78.83,39.62 U$1.34/A15
B.M2
  Top 0.254: U$1.33/A14 80.23,40.77 108.84,40.77 120.78,28.83 120.78,25.02 121.03,24.77 Q4.2
B.SW1
  Top 0.254: 116.49,22.51 118.52,20.49 118.52,18 118.11,17.59 U5.3 117.47,15.19 J5.2 114.76,14.4 111.66,11.3 R6.1 | 116.49,22.51 C12.2 | 116.49,22.51 113.76,22.51 113.28,22.99 113.28,26.92 103.76,36.45 77.34,36.45 76.93,36.45 U$1.36/A17
B.SW2
  Top 0.254: R5.1 130.97,9.27 129.7,10.54 127.28,10.54 126.01,9.27 124.66,9.27 J5.5 122.08,17.49 U5.5 120.08,23.17 C11.2 117.97,27.06 107.19,37.85 78.74,37.85 78.07,37.85 U$1.35/A16
BOARD_ID
  Bottom 0.254: J10.2 15.2,79.67 29.72,65.15 U$1.15/A1
C.M1
  Top 0.254: Q6.4 95.63,22.1 95.25,22.48 95.25,23.37 94.36,24.26 94.36,25.78 89.79,30.35 77.95,30.35 67.13,41.17 67.13,42.86 61.02,48.97 59.33,48.97 U$1.38/A19
C.M2
  Top 0.254: Q6.2 95.5,24.64 95.12,25.02 95.12,26.92 89.92,32.13 78.87,32.13 78.87,32.35 50.42,60.8 U$1.37/A18
C.SW1
  Top 0.254: R12.1 85.97,11.18 89.07,14.27 J8.2 91.79,15.06 U7.3 91.8,17.48 92.38,17.48 92.83,17.94 92.83,20.36 C18.2 88.68,24.51 80.87,24.51 60.2,45.18 U$1.32/A13
C.SW2
  Top 0.254: R11.1 105.28,9.14 104.01,10.41 101.59,10.41 100.33,9.14 98.97,9.14 J8.5 96.39,17.36 U7.5 94.39,23.04 C17.2 92.28,25.7 90.81,27.18 79.63,27.18 66.29,40.51 66.29,42.67 60.83,48.13 57.63,48.13 U$1.39/A20
D.M1  (via drill 0.51)
  Top 0.254: Q3.4 42.42,21.97 42.29,22.1 42.29,23.37 41.53,24.13 41.53,27.3 v36.7,32.13
  Bottom 0.254: U$1.19/A5/SCL 20.83,59.53 20.83,39.88 28.57,32.13 v36.7,32.13
D.M2  (via drill 0.51)
  Top 0.254: v38.73,33.78 42.42,30.1 42.42,24.89 42.8,24.51 Q3.2
  Bottom 0.254: U$1.18/A4/SDA 23.37,59.53 23.37,42.42 32,33.78 v38.73,33.78
D.SW1  (via drill 0.51)
  Top 0.254: 38.1,22.22 40.09,20.23 40.09,17.75 39.68,17.34 U3.3 39.05,14.94 J4.2 36.33,14.14 33.23,11.05 R4.1 | 38.1,22.22 C8.2 | v34.67,25.53 37.97,22.22 38.1,22.22
  Bottom 0.254: v34.67,25.53 34.67,27.26 40.21,32.8 40.21,34.51 39.08,35.64 37.1,35.64 U$1.9/CS
D.SW2  (via drill 0.51)
  Top 0.254: 39.71,24.85 41.65,22.92 U3.5 43.65,17.24 J4.5 46.23,9.02 47.59,9.02 48.85,10.29 51.27,10.29 52.54,9.02 R3.1 | 39.71,24.85 C7.2 | v37.97,28.07 39.71,26.33 39.71,24.85
  Bottom 0.254: U$1.11/MOSI 41.27,36.54 41.27,31.5 37.97,28.19 v37.97,28.07
GND
  pour Top: -2.92,105.79 154.81,105.79 154.81,-6.86 -2.92,-6.86
IO1
  Top 0.254: U$1.6 19.56,31.37 10.41,22.22 10.41,11.91 J2.1
IO2
  Top 0.254: U$1.7 22.1,32.13 12.32,22.35 12.32,12.55 J2.2
IO3
  Top 0.254: U$1.5 17.02,30.48 9.27,22.73 9.27,10.29 12.19,7.37 12.54,7.37 J2.3
IO4
  Top 0.254: U$1.12/MISO 34.8,43.02 15.02,23.24 J2.4
IO5
  Top 0.254: J2.5 13.17,5.46 11.56,5.46 7.75,9.27 7.75,23.11 14.48,29.84 U$1.4/CANRX
IO6
  Top 0.254: U$1.24 39.88,43.02 17.56,20.7 J2.6
IO7
  Top 0.254: U$1.27 31.62,29.69 31.62,5.59 30.73,4.7 21.46,4.7 20.1,6.06 J2.7
IO8
  Top 0.254: U$1.25 42.42,43.78 20.1,21.46 J2.8
IO9
  Top 0.254: U$1.26 44.96,44.55 29.72,29.3 29.72,6.6 25.88,6.6 J2.9
LEDS1  (via drill 0.51)
  Top 0.254: v50.55,79.5 52.5,81.45 U4.2
  Bottom 0.254: v50.55,79.5 50.55,71.47 41,61.92 39.41,61.92 38.76,61.26 38.76,59.68 U$1.8
LEDS2  (via drill 0.51)
  Top 0.254: v58.17,77.34 58.17,80.12 U4.5
  Bottom 0.254: v58.17,77.34 58.17,74.01 46.08,61.92 44.49,61.92 43.84,61.26 43.84,59.68 U$1.10/CS
N$1
  Top 0.254: F2.2 71.29,14.5 J3.6 72.33,13 J3.7
N$2
  Top 0.254: J3.8 72.84,15.03 72.84,20.83 | 72.84,20.83 74.11,22.1 Q2.5 | Q2.6 74.23,23.37 72.84,21.97 72.84,20.83
N$3  (via drill 0.51)
  Top 0.254: v72.71,24 73.34,24.64 | 73.34,24.64 74.61,25.91 Q2.8 | Q2.7 73.34,24.64
  Bottom 0.254: J3.3 67.25,18.54 v72.71,24
N$4
  Top 1.016: PP1.2 120.09,81.81 Q1.4
N$5
  Top 0.254: U4.6 58.37,80.97 58.94,80.97 67,89.03 PL2.2
N$6
  Top 0.254: U4.3 53.97,80.97 54.54,80.97 55.24,81.68 55.24,82.84 52.55,85.54 52.55,93.1 PL1.2
N$7
  Top 0.254: R2.2 60.96,3.98 62.3,2.64 63.78,2.64 J3.10
N$8
  Top 0.254: R1.2 76.21,1.39 J3.12
N$9
  Top 0.254: F3.2 45.15,14.37 J4.6 46.19,12.87 J4.7
N$10
  Top 0.254: J4.8 46.7,14.91 46.7,20.7 | 46.7,20.7 47.97,21.97 Q3.5 | Q3.6 48.09,23.24 46.7,21.84 46.7,20.7
N$11  (via drill 0.51)
  Top 0.254: v46.57,23.88 47.2,24.51 | 47.2,24.51 48.47,25.78 Q3.8 | Q3.7 47.2,24.51
  Bottom 0.254: J4.3 41.11,18.41 v46.57,23.88
N$12
  Top 0.254: R4.2 34.82,3.85 36.16,2.51 37.64,2.51 J4.10
N$13
  Top 1.016: Q5.4 101.91,87.81 PP2.2
N$14
  Top 1.016: Q7.4 98.09,82.62 PP2.3
N$15
  Top 1.016: Q8.4 94.28,86 PP2.4
N$16
  Top 1.016: Q9.4 90.47,91.19 PP2.5
N$17
  Top 0.254: R3.2 50.07,1.26 J4.12
N$18
  Top 0.254: F4.2 123.58,14.63 J5.6 124.62,13.13 J5.7
N$19
  Top 0.254: J5.8 125.12,15.16 125.12,20.95 | 125.12,20.95 126.39,22.22 Q4.5 | Q4.6 126.52,23.49 125.12,22.1 125.12,20.95
N$20  (via drill 0.51)
  Top 0.254: v125,24.13 125.63,24.77 | 125.63,24.77 126.9,26.04 Q4.8 | Q4.7 125.63,24.77
  Bottom 0.254: J5.3 119.54,18.67 v125,24.13
N$21
  Top 0.254: R6.2 113.25,4.1 114.59,2.76 116.07,2.76 J5.10
N$22
  Top 0.254: R5.2 128.5,1.51 J5.12
N$23
  Top 0.254: R9.1 LED1.A
N$24
  Top 0.254: R10.1 102.67,55.25 LED2.A
N$25
  Top 0.254: R7.1 87.38,51.76 LED3.A
N$26
  Top 0.254: R8.1 LED4.A
N$27
  Top 0.254: J10.3 8.07,82.21 R13.1
N$28
  Top 0.254: F6.2 97.89,14.5 J8.6 98.93,13 J8.7
N$29
  Top 0.254: J8.8 99.44,15.03 99.44,20.83 | 99.44,20.83 100.71,22.1 Q6.5 | Q6.6 100.83,23.37 99.44,21.97 99.44,20.83
N$30  (via drill 0.51)
  Top 0.254: v99.31,24 99.94,24.64 | 99.94,24.64 101.21,25.91 Q6.8 | Q6.7 99.94,24.64
  Bottom 0.254: J8.3 93.85,18.54 v99.31,24
N$31
  Top 0.254: R12.2 87.56,3.98 88.9,2.64 90.38,2.64 J8.10
N$32
  Top 0.254: R11.2 102.81,1.39 J8.12
N$33
  Top 0.254: J10.1 7.96,77.13 R14.2
N$34
  Top 1.016: J7.2 125.24,93.67 PP1.1
N$35
  Top 1.016: J1.2 107.05,93.67 PP2.1
PWM1
  Top 0.254: U$1.14/A0 36.61,65.15 110.62,65.15 117.72,72.25 Q1.1
PWM2
  Top 0.254: U$1.16/A2 33.43,67.06 98.81,67.06 105.72,73.97 Q5.1
PWM3
  Top 0.254: U$1.17/A3 32.8,68.96 93.34,68.96 96.72,72.34 Q7.1
PWM4
  Top 0.254: U$1.20/A6 27.08,70.87 85.47,70.87 87.72,73.11 Q8.1
PWM5
  Top 0.254: U$1.21/A7 28.49,74.82 Q9.1
VCC  (via drill 0.51)
  Top 0.254: U3.1 38.95,19.14 C9.2 35.73,19.94 v33.27,19.94 | U2.1 65.09,19.27 C6.2 v60.83,19.27 | U7.1 91.69,19.27 C20.2 v87.5,19.27 | U5.1 117.38,19.39 C13.2 v113.03,19.39 | R13.2 v11.81,82.13 | R9.2 v97.54,59.82
  pour Bottom: -2.79,106.17 155.19,106.17 155.19,-8 -2.79,-8

### Text on the board
tPlace: 24V 12V | 24V 12V | 5V D G | 5V G 24V | 5V D G | + | + | 5V G | LED1 | LED2 | RGBW | UV | 5V | 12V G | 12V | 12V G 24V | 5V | 12V | VCC | 24V | 24V | 24V G | DOOR D | DOOR C | DOOR B | DOOR A | V G P1 P2 P3 P4 | 24V G | IO PANEL